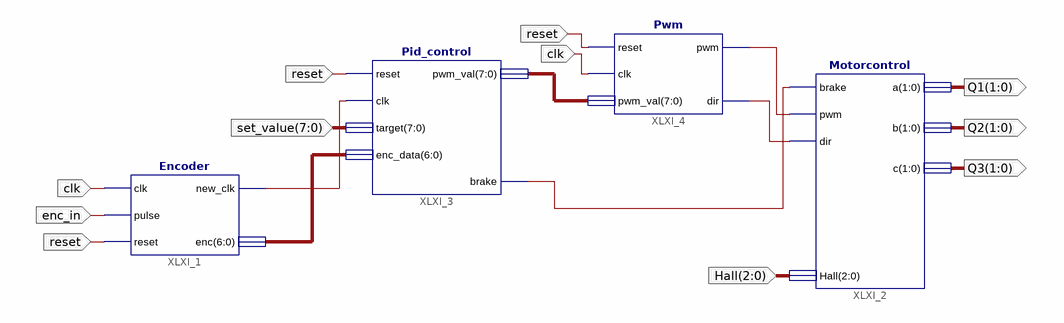
[diagram p0: schematic sheet 1]
// Xilinx ISE schematic Motormodule.sch (spartan6) as structural Verilog: 4 symbols, 8 ports
module Motormodule (
  input  [7:0] set_value,
  input  reset,
  input  clk,
  input  enc_in,
  input  [2:0] Hall,
  output [1:0] Q1,
  output [1:0] Q2,
  output [1:0] Q3
);

  wire XLXN_4, XLXN_5, XLXN_22, XLXN_23;
  wire [6:0] XLXN_6;
  wire [7:0] XLXN_3;

  Encoder XLXI_1 (.clk(clk), .pulse(enc_in), .reset(reset), .new_clk(XLXN_22), .enc(XLXN_6));
  Motorcontrol XLXI_2 (.brake(XLXN_23), .pwm(XLXN_5), .dir(XLXN_4), .a(Q1), .b(Q2), .c(Q3), .Hall(Hall));
  Pid_control XLXI_3 (
    .reset(reset), .clk(XLXN_22), .target(set_value), .enc_data(XLXN_6), .pwm_val(XLXN_3), .brake(XLXN_23));
  Pwm XLXI_4 (.reset(reset), .clk(clk), .pwm_val(XLXN_3), .pwm(XLXN_5), .dir(XLXN_4));
endmodule
